# Altium schematic sheet temperature_sensor.SchDoc
size 297 x 209 mm
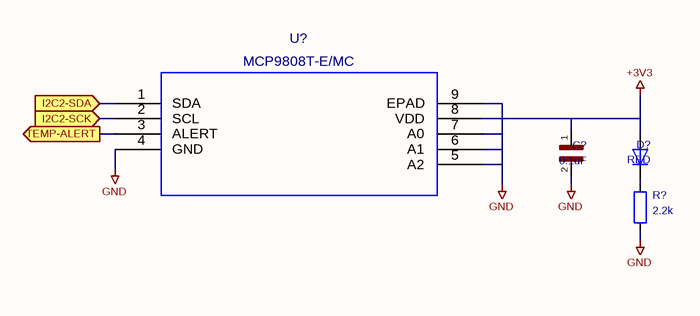
[diagram p0: temperature_sensor.SchDoc]

## Parts
C?  0.1uF  [C_0603_1608Metric]
D?  RED  [D_0603_1608Metric]
R?  2.2k  [R_0603_1608Metric]
U?  MCP9808T-E/MC  [MCP9808T-E&slash_MC]

## Ports
I2C2-SCK (in), I2C2-SDA (in), TEMP-ALERT (out)

## Nets
+3V3: C?.1 D?.1(A) U?.8(VDD)
GND: C?.2 R?.2 U?.4(GND) U?.5(A2) U?.6(A1) U?.7(A0) U?.9(EPAD)
I2C2-SCK: U?.2(SCL) ; port I2C2-SCK
I2C2-SDA: U?.1(SDA) ; port I2C2-SDA
TEMP-ALERT: U?.3(ALERT) ; port TEMP-ALERT
NetD?_2: D?.2(K) R?.1

## Notes on the sheet
- 1
- 2
- 3
- 4
- 5
- 6
- A
- B
- C
- D
- Title:
- File: temperature_sensor.kicad_sch
- Sheet: /
- KiCad E.D.A.  kicad (5.1.4)-1
- Size: A4
- Date:
- Rev:
- Id: 1/1

## Library data of the parts
C? = CL10B104KB8NNNL: Value: 0.1uF; Footprint: Capacitor_SMD:C_0603_1608Metric
D? = DIODE: Spice_Netlist_Enabled: Y; Spice_Primitive: D; Value: RED; Footprint: Diode_SMD:D_0603_1608Metric
R? = R: Value: 2.2k; Footprint: Resistor_SMD:R_0603_1608Metric
U? = MCP9808T-E{slash}MC: Value: MCP9808T-E/MC; Footprint: qset-footprints:MCP9808T-E&slash_MC